# Altium schematic sheet RS485.SchDoc
size A4
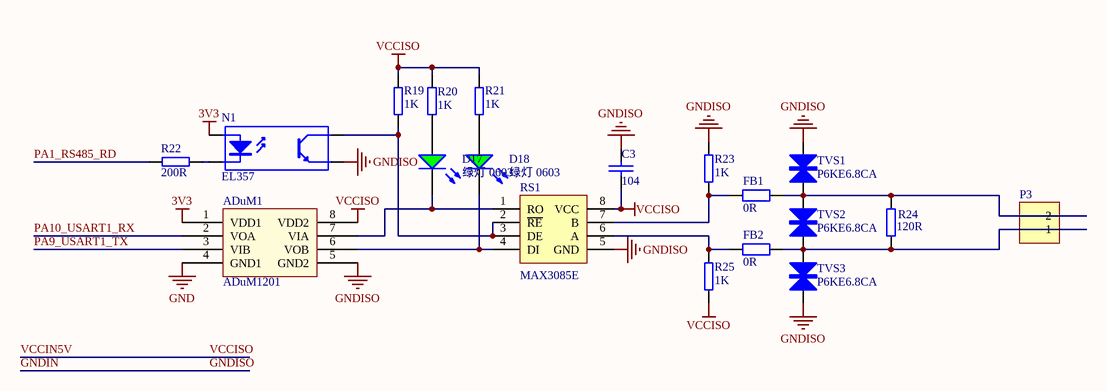
[diagram p0: RS485.SchDoc]

## Parts
ADuM1  ADuM1201  [SOIC-8]
C3  104  [LC-0603_C]
D17  绿灯 0603  [LC-0603_LED_S1]
D18  绿灯 0603  [LC-0603_LED_S1]
FB1  0R  [LC-0603_L]
FB2  0R  [LC-0603_L]
N1  EL357  [lc-sop-4_P2.54]
P3  Header 2  [WJ2EDGR508-2]  (value not drawn)
R19  1K  [LC-0603_R]
R20  1K  [LC-0603_R]
R21  1K  [LC-0603_R]
R22  200R  [LC-0603_R]
R23  1K  [LC-0603_R]
R24  120R  [LC-0603_R]
R25  1K  [LC-0603_R]
RS1  MAX3085E  [SOIC-8]
TVS1  P6KE6.8CA  [TVS]
TVS2  P6KE6.8CA  [TVS]
TVS3  P6KE6.8CA  [TVS]

## Nets
3V3: ADuM1.1(VDD1) N1.1(A)
GND: ADuM1.4(GND1)
GNDIN: ADuM1.5(GND2) C3.1 N1.3(E) R23.1 RS1.5(GND) TVS1.2 TVS3.1  [also labelled GNDISO]
VCCIN5V: ADuM1.8(VDD2) C3.2 R19.1 R20.2 R21.1 R25.2 RS1.8(VCC)  [also labelled VCCISO]
PA1_RS485_RD: R22.1
PA9_USART1_TX: ADuM1.3(VIB)
PA10_USART1_RX: ADuM1.2(VOA)
NetADuM1_6: ADuM1.6(VOB) D18.K RS1.4(DI)
NetADuM1_7: ADuM1.7(VIA) D17.K RS1.1(RO)
NetD17_A: D17.A R20.1
NetD18_A: D18.A R21.2
NetFB1_1: FB1.1 P3.2 R24.2 TVS1.1 TVS2.2
NetFB1_2: FB1.2 R23.2 RS1.7(B)
NetFB2_1: FB2.1 P3.1 R24.1 TVS2.1 TVS3.2
NetFB2_2: FB2.2 R25.1 RS1.6(A)
NetN1_2: N1.2(K) R22.2
NetN1_4: N1.4(C) R19.2 RS1.2(~{RE}) RS1.3(DE)

## Library data of the parts
C3 = CAP
D17 D18 = 0603 绿灯: 发光二极管; ComponentLink1Description: 供应商链接; ComponentLink1URL: http://www.szlcsc.com/product/details_73152.html; Package: 0603; Supplier: LC; SuppliersPartNumber: C72043
FB1 FB2 = Res2: Resistor; Published: 8-Jun-2000; LatestRevisionDate: 17-Jul-2002; LatestRevisionNote: Re-released for DXP Platform.; PackageReference: AXIAL-0.4; Publisher: Altium Limited; Value: 0R
N1 = ST188: 反射式光电传感器; Published: 24-Mar-1999; LatestRevisionDate: 04-Mar-2005; LatestRevisionNote: Sch pins 3 & 4 Swapped.; DatasheetDocument: Nov-2003; PackageReference: DIP-4; Publisher: Altium Limited
P3 = Header 2: Header, 2-Pin; LatestRevisionDate: 17-Jul-2002; LatestRevisionNote: Re-released for DXP Platform.; Publisher: Altium Limited
R19-R22 = RES2
R23-R25 = RES
TVS1-TVS3 = TVS